# Altium schematic sheet razbotMotorDriverToshiba.SchDoc
size A
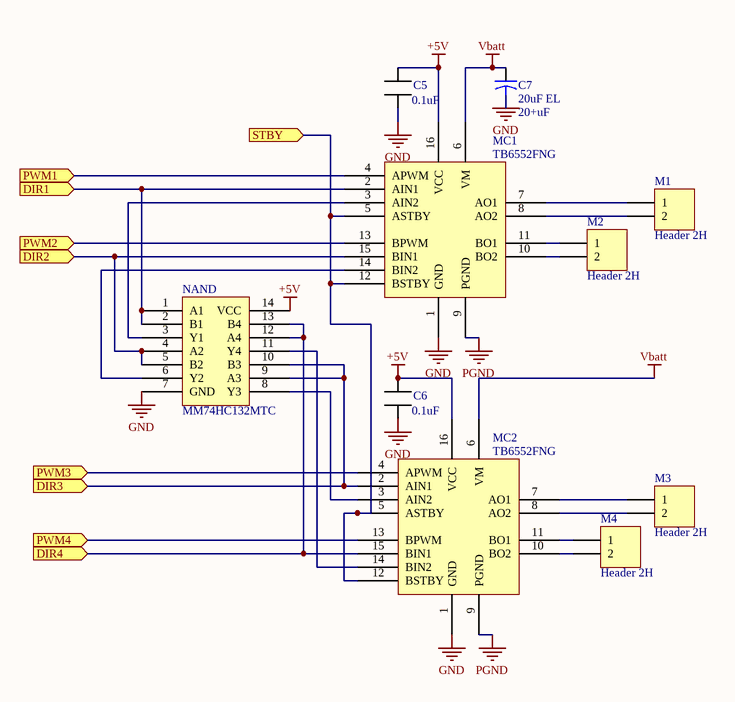
[diagram p0: razbotMotorDriverToshiba.SchDoc]

## Parts
C5  value 0.1uF  [J1-0603]  (hidden comment: 0.1uF 0603)
C6  value 0.1uF  [J1-0603]  (hidden comment: 0.1uF 0603)
C7  20uF EL  value 20+uF  [CAPR5-4X5]
M1  Header 2H  [HDR1X2H]
M2  Header 2H  [HDR1X2H]
M3  Header 2H  [HDR1X2H]
M4  Header 2H  [HDR1X2H]
MC1  TB6552FNG  [SSOP16]
MC2  TB6552FNG  [SSOP16]
NAND  MM74HC132MTC  [TSSOP14]

## Ports
DIR1 (in), DIR2 (in), DIR3 (in), DIR4 (in), PWM1 (in), PWM2 (in), PWM3 (in), PWM4 (in), STBY (in)

## Nets
+5V: C5.2(P2) C6.2(P2) MC1.16(VCC) MC2.16(VCC) NAND.14(VCC)
GND: C5.1(P1) C6.1(P1) C7.2 MC1.1(GND) MC2.1(GND) NAND.7(GND)
PGND: MC1.9(PGND) MC2.9(PGND)
Vbatt: C7.1 MC1.6(VM) MC2.6(VM)
DIR1: MC1.2(AIN1) NAND.1(A1) NAND.2(B1) ; port DIR1
DIR2: MC1.15(BIN1) NAND.4(A2) NAND.5(B2) ; port DIR2
DIR3: MC2.2(AIN1) NAND.9(A3) NAND.10(B3) ; port DIR3
DIR4: MC2.15(BIN1) NAND.12(A4) NAND.13(B4) ; port DIR4
PWM1: MC1.4(APWM) ; port PWM1
PWM2: MC1.13(BPWM) ; port PWM2
PWM3: MC2.4(APWM) ; port PWM3
PWM4: MC2.13(BPWM) ; port PWM4
STBY: MC1.5(ASTBY) MC1.12(BSTBY) MC2.5(ASTBY) MC2.12(BSTBY) ; port STBY
NetM1_1: M1.1 MC1.7(AO1)
NetM1_2: M1.2 MC1.8(AO2)
NetM2_1: M2.1 MC1.11(BO1)
NetM2_2: M2.2 MC1.10(BO2)
NetM3_1: M3.1 MC2.7(AO1)
NetM3_2: M3.2 MC2.8(AO2)
NetM4_1: M4.1 MC2.11(BO1)
NetM4_2: M4.2 MC2.10(BO2)
NetMC1_3: MC1.3(AIN2) NAND.3(Y1)
NetMC1_14: MC1.14(BIN2) NAND.6(Y2)
NetMC2_3: MC2.3(AIN2) NAND.8(Y3)
NetMC2_14: MC2.14(BIN2) NAND.11(Y4)

## Library data of the parts
C5 C6 = CAP: Capacitor
C7 = Cap2: Capacitor; Published: 23-Sep-2002; PackageReference: CAPR5-4X5; Publisher: Altium Limited
M1-M4 = Header 2H: Header, 2-Pin, Right Angle; LatestRevisionDate: 17-Jul-2002; LatestRevisionNote: Re-released for DXP Platform.; Publisher: Altium Limited
MC1 MC2 = TB6552FNG: 2CH 1A PMIC
NAND = MM74HC132MTC: 4Ch NAND Gate